# Altium project avris_vest.PrjPcb
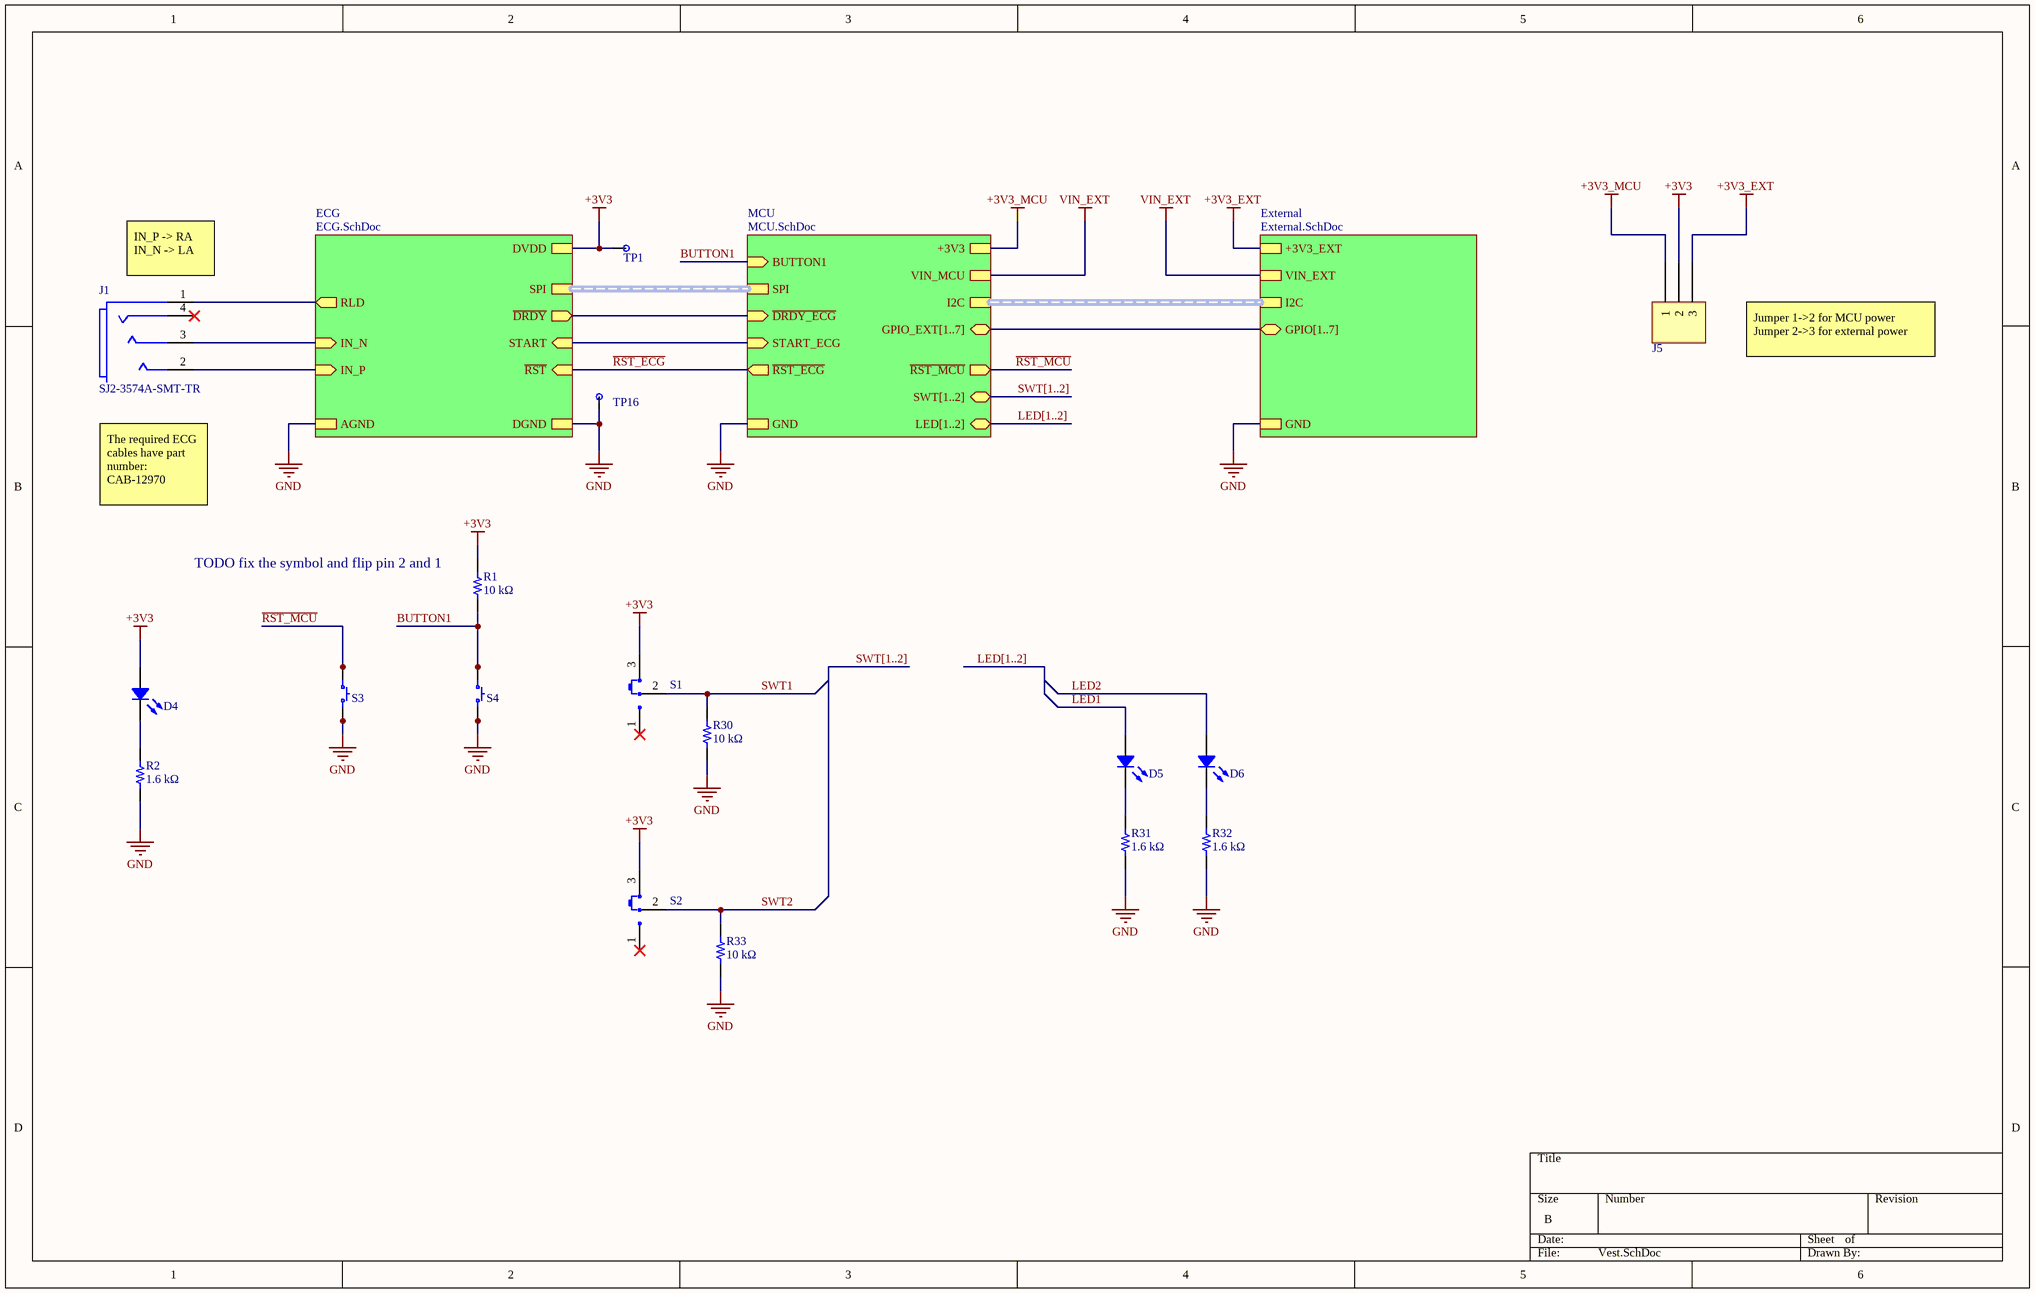
[diagram p0: Vest.SchDoc]
4 sheets, 89 parts. Net scope: strictly hierarchical (ports join the sheet entries above them; power ports are local).
Board file: Vest.PcbDoc
Sheets:
  Vest.SchDoc
    ECG = ECG.SchDoc
    MCU = MCU.SchDoc
    External = External.SchDoc

## Sheet Vest.SchDoc
size B; DocumentNumber: 1; SheetNumber: 1; SheetTotal: 4

### Parts
D4  Red  [LED 1206_3216 RED]  (value not drawn)
D5  Red  [LED 1206_3216 RED]  (value not drawn)
D6  Red  [LED 1206_3216 RED]  (value not drawn)
J1  SJ2-3574A-SMT-TR  [CUI SJ2-3574A-SMT-TR]
J5  0022272031  [MOLEX KK 0022272031]  (value not drawn)
R1  10 kΩ  [RES 0402_1005]
R2  1.6 kΩ  [RES 0402_1005]
R30  10 kΩ  [RES 0402_1005]
R31  1.6 kΩ  [RES 0402_1005]
R32  1.6 kΩ  [RES 0402_1005]
R33  10 kΩ  [RES 0402_1005]
S1  CUS-12TB  [NCE CUS-12TB]  (value not drawn)
S2  CUS-12TB  [NCE CUS-12TB]  (value not drawn)
S3  1571563-4  [TE FSM4JSMA]  (value not drawn)
S4  1571563-4  [TE FSM4JSMA]  (value not drawn)
TP1  TP2MM  [Test Point 2MM]  (value not drawn)  (no BOM)
TP16  TP2MM  [Test Point 2MM]  (value not drawn)  (no BOM)

### Sub-sheets
ECG = ECG.SchDoc: ~{RST} (in), START (in), ~{DRDY} (out), AGND, DGND, SPI (harness SPI), DVDD, IN_N (in), IN_P (in), RLD (out)
External = External.SchDoc: GND, GPIO[1..7] (bidir), I2C (harness I2C), +3V3_EXT, VIN_EXT
MCU = MCU.SchDoc: ~{RST_ECG} (out), ~{DRDY_ECG} (in), GND, SPI (harness SPI), +3V3, VIN_MCU, START_ECG (in), ~{RST_MCU} (out), I2C (harness I2C), GPIO_EXT[1..7] (bidir), SWT[1..2] (bidir), LED[1..2] (bidir), BUTTON1 (in)

### Nets
+3V3: D4.1 J5.2 R1.1 S1.3 S2.3 TP1.1 ; sheet ECG/DVDD
+3V3_EXT: J5.3 ; sheet External/+3V3_EXT
+3V3_MCU: J5.1 ; sheet MCU/+3V3
GND: R2.1 R30.2 R31.1 R32.1 R33.2 S3.3 S3.4 S4.3 S4.4 TP16.1 ; sheet ECG/AGND, sheet ECG/DGND, sheet MCU/GND, sheet External/GND
VIN_EXT: sheet MCU/VIN_MCU, sheet External/VIN_EXT
BUTTON1: R1.2 S4.1 S4.2 ; sheet MCU/BUTTON1
~{DRDY_ECG}: sheet ECG/~{DRDY}, sheet MCU/~{DRDY_ECG}
IN_N: J1.3(ring_1) ; sheet ECG/IN_N
IN_P: J1.2(tip) ; sheet ECG/IN_P
LED1: D5.1
LED2: D6.1
~{RST_ECG}: sheet ECG/~{RST}, sheet MCU/~{RST_ECG}
~{RST_MCU}: S3.1 S3.2 ; sheet MCU/~{RST_MCU}  [project net ~{RST_MCU}]
START_ECG: sheet ECG/START, sheet MCU/START_ECG
SWT1: R30.1 S1.2(COM)
SWT2: R33.1 S2.2(COM)
NetD4_2: D4.2 R2.2
NetD5_2: D5.2 R31.2
NetD6_2: D6.2 R32.2
NetJ1_1: J1.1(sleeve) ; sheet ECG/RLD

Not connected (* = marked no-connect by the designer): J1 4(ring_2)*; S1 1*; S2 1*

### Buses and harness runs
bus LED[1..2]
bus LED[1..2] = sheet MCU/LED[1..2]
bus sheet External/GPIO[1..7] = sheet MCU/GPIO_EXT[1..7]
bus SWT[1..2]
bus SWT[1..2] = sheet MCU/SWT[1..2]
harness sheet ECG/SPI = sheet MCU/SPI
harness sheet External/I2C = sheet MCU/I2C

### Notes on the sheet
- (near J1) IN_P -> RA
  IN_N -> LA
- Jumper 1->2 for MCU power
  Jumper 2->3 for external power
- The required ECG cables have part number: CAB-12970
- (near R1) TODO fix the symbol and flip pin 2 and 1

### Library data of the parts
D4-D6 = APT3216LSECK/J3-PRV: LED RED CLEAR 2SMD; Manufacturer: Kingbright; Configuration: Standard; Current - Test: 2mA; Lens Color: Colorless; Lens Size: 1.90mm x 1.60mm; Lens Style: Rectangle with Flat Top; Millicandela Rating: 40mcd; Viewing Angle: 120°; Voltage - Forward (Vf) (Typ): 1.8V; Wavelength - Dominant: 625nm; Wavelength - Peak: 640nm; Part Number: APT3216LSECK/J3-PRV; Color: Red; ComponentLink1Description: Datasheet; ComponentLink1URL: http://www.kingbrightusa.com/images/catalog/SPEC/APT3216LSECK-J3-PRV.pdf; ComponentLink2Description: DigiKey Link; ComponentLink2URL: http://digikey.com/product-detail/en/kingbright/APT3216LSECK-J3-PRV/754-1940-1-ND/5177470; Device Package: 1206 (3216 Metric); Height (Max): 0.75mm; LastUpdated: 2020-02-03 5:16:26 PM; Lens Transparency: Clear; Lifecycle Status: Active; Minimum Order: 1; Mounting Type: Surface Mount; Package / Case: 1206 (3216 Metric); Packaging: TapeAndReel; Part Status: Active; Price: 0.16; Series: HELI2; Size / Dimension: 3.20mm L x 1.60mm W; Supplier 1: DigiKey; Supplier Part Number 1: 754-1940-1-ND; Supplier Device Package: 2-SMD; Value: Red
J1 = SJ2-3574A-SMT-TR: AUDIO JACK, 3.5 MM, RT, 4 CONDUC; Manufacturer: CUI Devices; Connector Type: Phone Jack; Gender: Female; Internal Switch(s): Does Not Contain Switch; Mating Length/Depth: 0.551"" (14.00mm); Current Rating: 1A; Shielding: Unshielded; Voltage - Rated: 12VDC; Number of Positions/Contacts: 4 Conductors, 4 Contacts; Part Number: SJ2-3574A-SMT-TR; ComponentLink1Description: Datasheet; ComponentLink1URL: https://www.cuidevices.com/product/resource/digikeypdf/sj2-357x-smt.pdf; ComponentLink2Description: DigiKey Link; ComponentLink2URL: https://www.digikey.com/en/products/detail/cui-devices/SJ2-3574A-SMT-TR/6619530?s=N4IgTCBcDaIMoCkwFoDMBWA7AFgILLgFkAVZYgJRAF0BfIA; Device Package: Tape and Reel; Features: Board Guide; LastUpdated: 2020-08-26 1:45:56 AM; Lifecycle Status: 1; Minimum Order: 1; Mounting Type: Surface Mount, Right Angle; Packaging: Tape and Reel; Part Status: Active; Price: 1.15; Series: SJ2; Supplier 1: DigiKey; Supplier Part Number 1: CP-SJ2-3574A-SMT-TR-ND
J5 = 0022272031: CONN HEADER VERT 3POS 2.54MM; Manufacturer: Molex; Contact Length - Mating: 0.295" (7.49mm); Contact Length - Post: 0.140" (3.56mm); Material Flammability Rating: UL94 V-0; Number of Positions: 3; Number of Positions Loaded: All; Overall Contact Length: 0.560" (14.22mm); Pitch - Mating: 0.100" (2.54mm); Shrouding: Shrouded - 1 Wall; Style: Board to Cable/Wire; Part Number: 0022272031; ComponentLink1Description: Datasheet; ComponentLink1URL: https://www.molex.com/pdm_docs/sd/022272031_sd.pdf; ComponentLink2Description: DigiKey Link; ComponentLink2URL: http://digikey.com/product-detail/en/molex/0022272031/WM4112-ND/1130578; Connector Type: Header; Contact Finish - Mating: Tin; Contact Finish - Post: Tin; Contact Finish Thickness - Mating: 100.0µin (2.54µm); Contact Material: Brass; Contact Shape: Square; Contact Type: Male Pin; Fastening Type: Friction Lock; Insulation Color: Natural; Insulation Height: 0.461" (11.70mm); Insulation Material: Polyamide (PA), Nylon; LastUpdated: 2020-02-03 5:11:43 PM; Lifecycle Status: Active; Minimum Order: 1; Mounting Type: Through Hole; Number of Rows: 1; Packaging: Bulk; Part Status: Active; Price: 0.37; Series: KK 6410; Supplier 1: DigiKey; Supplier Part Number 1: WM4112-ND; Termination: Solder
R1 R30 R33 = AC0402FR-0710KL: RES SMD 10K OHM 1% 1/16W 0402; Manufacturer: Yageo; Power (Watts): 0.063W, 1/16W; Temperature Coefficient: ±100ppm/°C; Value: 10 kOhms; Part Number: AC0402FR-0710KL; ComponentLink1Description: Datasheet; ComponentLink1URL: https://www.yageo.com/upload/media/product/productsearch/datasheet/rchip/PYu-AC_51_RoHS_L_7.pdf; ComponentLink2Description: DigiKey Link; ComponentLink2URL: http://digikey.com/product-detail/en/yageo/AC0402FR-0710KL/YAG3436CT-ND/6006285; Composition: Thick Film; Device Package: 0402 (1005 Metric); Features: Automotive AEC-Q200, Moisture Resistant; Height - Seated (Max): 0.015" (0.37mm); LastUpdated: 2020-02-19 6:28:05 AM; Lifecycle Status: Active; Minimum Order: 1; Number of Terminations: 2; Operating Temperature: -55°C ~ 155°C; Package / Case: 0402 (1005 Metric); Packaging: CutTape; Part Status: Active; Price: 0.10; Ratings: AEC-Q200; Resistance: 10 kΩ; Series: AC; Size / Dimension: 0.039" L x 0.020" W (1.00mm x 0.50mm); Supplier 1: DigiKey; Supplier Part Number 1: YAG3436CT-ND; Supplier Device Package: 0402; Tolerance: ±1%
R2 R31 R32 = CRCW04021K60FKED: RES SMD 1.6K OHM 1% 1/16W 0402; Manufacturer: Vishay Dale; Power (Watts): 0.063W, 1/16W; Temperature Coefficient: ±100ppm/°C; Value: 1.6 kOhms; Part Number: CRCW04021K60FKED; ComponentLink1Description: Datasheet; ComponentLink1URL: http://www.vishay.com/docs/20035/dcrcwe3.pdf; ComponentLink2Description: DigiKey Link; ComponentLink2URL: http://digikey.com/product-detail/en/vishay-dale/CRCW04021K60FKED/541-1.60KLCT-ND/1183144; Composition: Thick Film; Device Package: 0402 (1005 Metric); Features: Automotive AEC-Q200; Height - Seated (Max): 0.016" (0.40mm); LastUpdated: 2020-02-19 6:28:05 AM; Lifecycle Status: Active; Minimum Order: 1; Number of Terminations: 2; Operating Temperature: -55°C ~ 155°C; Package / Case: 0402 (1005 Metric); Packaging: CutTape; Part Status: Active; Price: 0.10; Ratings: AEC-Q200; Resistance: 1.6 kΩ; Series: CRCW; Size / Dimension: 0.039" L x 0.020" W (1.00mm x 0.50mm); Supplier 1: DigiKey; Supplier Part Number 1: 541-1.60KLCT-ND; Supplier Device Package: 0402; Tolerance: ±1%
S1 S2 = CUS-12TB: SWITCH SLIDE SPDT 300MA 4V; Manufacturer: Nidec Copal Electronics; Actuator Length: 1.50mm; Actuator Type: Standard; Contact Timing: Non-Shorting (BBM); Current Rating (Amps): 300mA (DC); Switch Function: On-On; Part Number: CUS-12TB; Circuit: SPDT; ComponentLink1Description: Datasheet; ComponentLink1URL: https://www.nidec-copal-electronics.com/e/catalog/switch/cus.pdf; ComponentLink2Description: DigiKey Link; ComponentLink2URL: https://www.digikey.com/product-detail/en/nidec-copal-electronics/CUS-12TB/563-1102-2-ND/1124222; Contact Finish: Gold; Contact Material: Copper Alloy; LastUpdated: 2020-03-02 6:46:22 AM; Lifecycle Status: Active; Minimum Order: 1; Mounting Type: Surface Mount, Right Angle; Operating Temperature: -20°C ~ 70°C; Packaging: TapeAndReel; Part Status: Active; Price: 0.71; Series: CUS; Supplier 1: DigiKey; Supplier Part Number 1: 563-1102-1-ND; Termination Style: Gull Wing; Voltage Rating - AC: 4V; Voltage Rating - DC: 4V
S3 S4 = 1571563-4: SWITCH TACTILE SPST-NO 0.05A 24V; Manufacturer: TE Connectivity ALCOSWITCH Switches; Actuator Height off PCB, Vertical: 5.00mm; Actuator Orientation: Top Actuated; Actuator Type: Standard; Contact Rating @ Voltage: 0.05A @ 24VDC; Illumination: Non-Illuminated; Operating Force: 260gf; Outline: 6.00mm x 6.00mm; Switch Function: Off-Mom; Part Number: 1571563-4; Circuit: SPST-NO; ComponentLink1Description: Datasheet; ComponentLink1URL: https://www.te.com/commerce/DocumentDelivery/DDEController?Action=srchrtrv&DocNm=1308111-1_SWITCHES_CORE_PROGRAM_CATALOG&DocType=CS&DocLang=English; ComponentLink2Description: DigiKey Link; ComponentLink2URL: http://digikey.com/product-detail/en/te-connectivity-alcoswitch-switches/1571563-4/450-2055-1-ND/4569745; LastUpdated: 2020-12-16 5:46:49 AM; Lifecycle Status: Active; Minimum Order: 1; Mounting Type: Surface Mount; Operating Temperature: -35°C ~ 85°C; Packaging: TapeAndReel; Part Status: Active; Price: 0.16; Series: FSMJSMA; Supplier 1: DigiKey; Supplier Part Number 1: 450-2055-1-ND; Termination Style: Gull Wing
TP1 TP16 = TP2MM: 2MM Circular Test Point; Part Number: TP2MM

## Sheet ECG.SchDoc
size C; DocumentNumber: 2; SheetNumber: 2; SheetTotal: 4
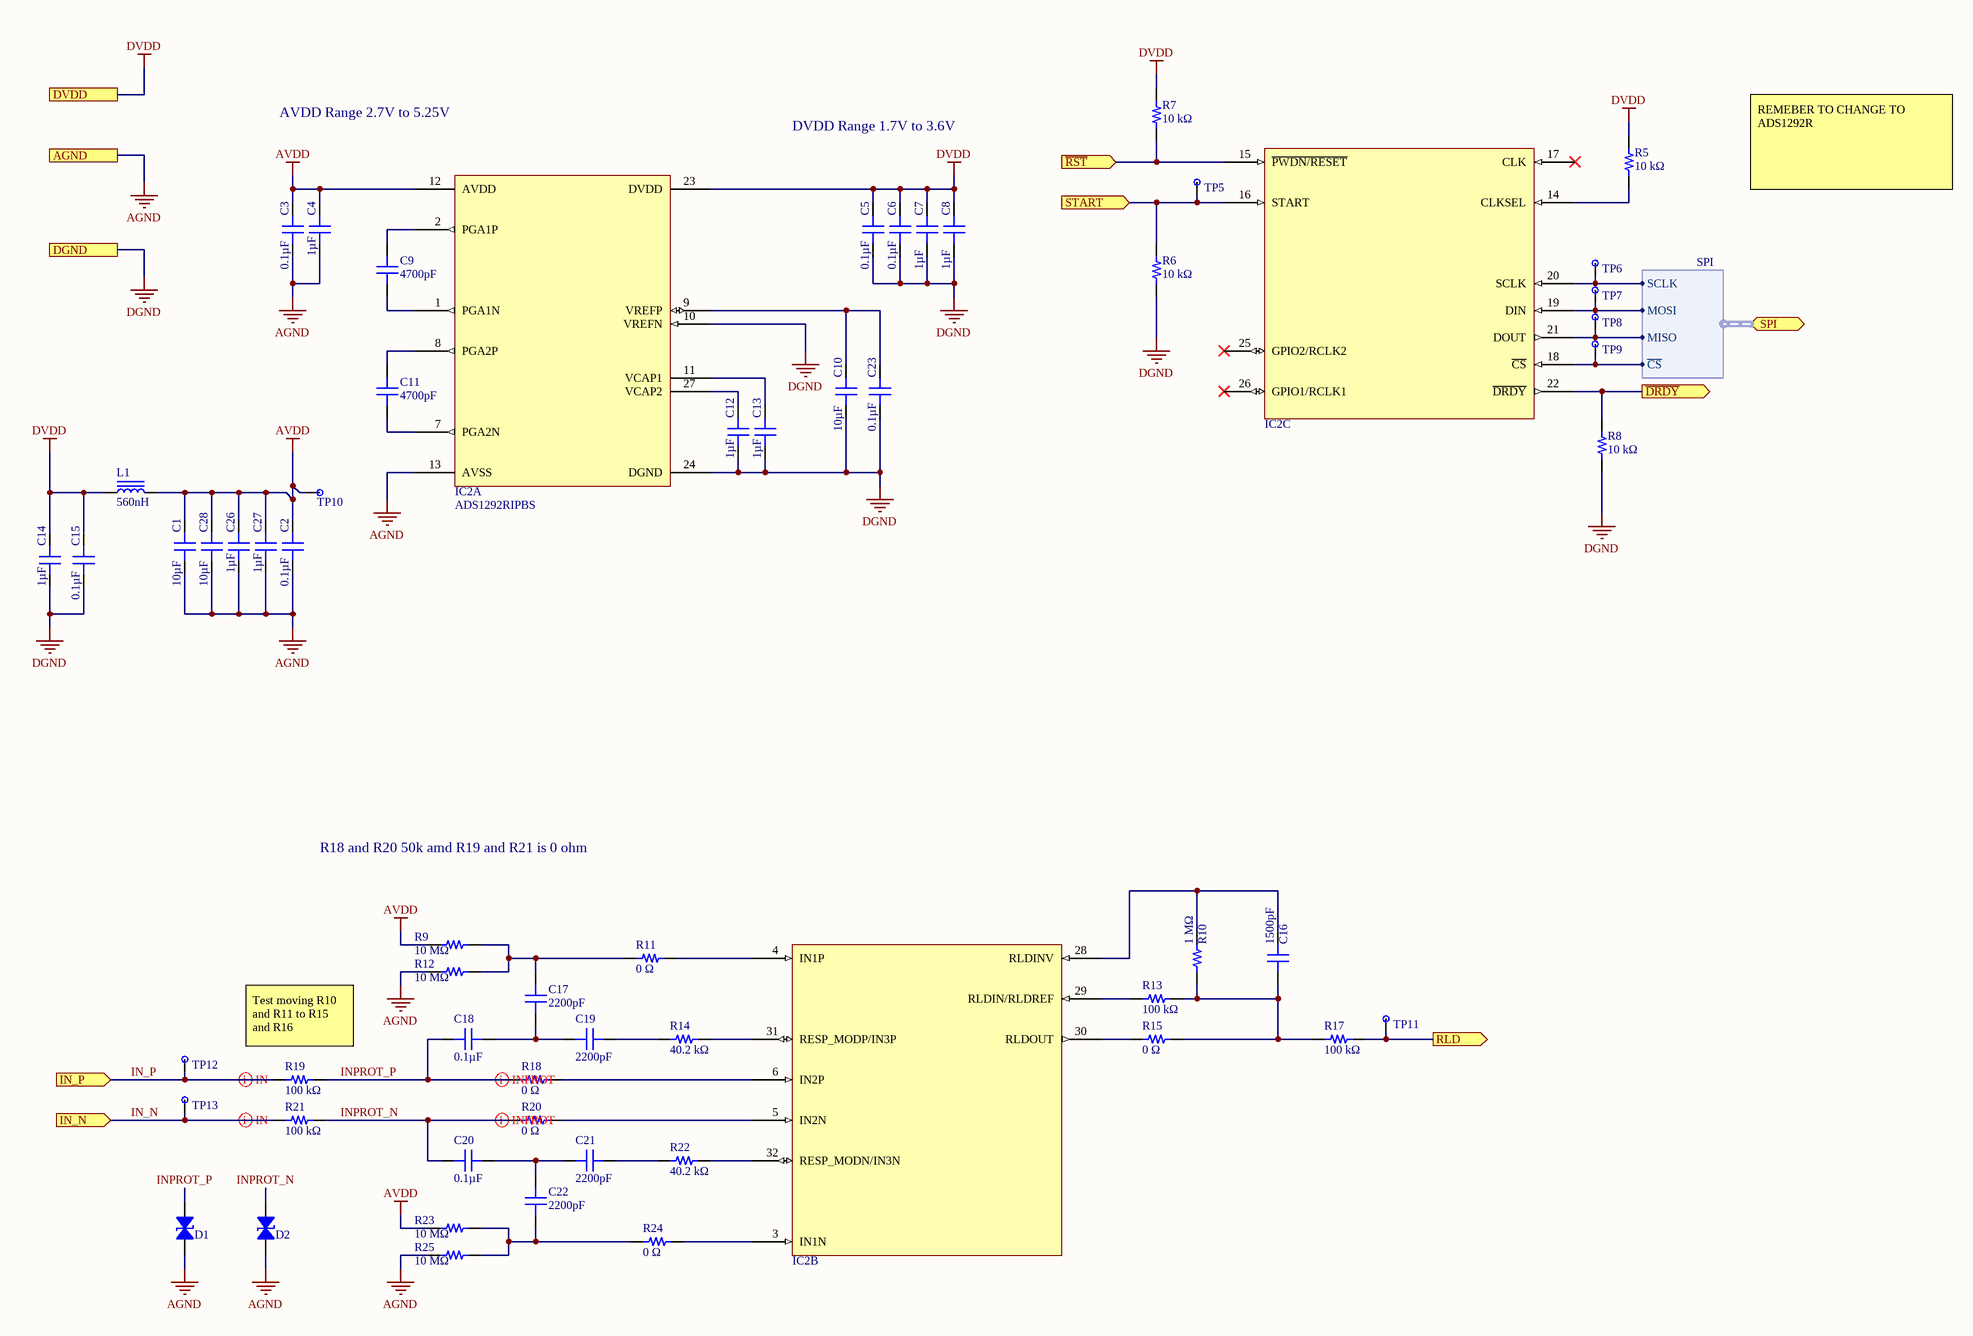
[diagram p1: ECG.SchDoc]

### Parts
C1  10µF  [CAP 0402_1005]
C2  0.1µF  [CAP 0402_1005]
C3  0.1µF  [CAP 0402_1005]
C4  1µF  [CAP 0402_1005]
C5  0.1µF  [CAP 0402_1005]
C6  0.1µF  [CAP 0402_1005]
C7  1µF  [CAP 0402_1005]
C8  1µF  [CAP 0402_1005]
C9  4700pF  [CAP 0402_1005]
C10  10µF  [CAP 0402_1005]
C11  4700pF  [CAP 0402_1005]
C12  1µF  [CAP 0402_1005]
C13  1µF  [CAP 0402_1005]
C14  1µF  [CAP 0402_1005]
C15  0.1µF  [CAP 0402_1005]
C16  1500pF  [CAP 0402_1005]
C17  2200pF  [CAP 0402_1005]
C18  0.1µF  [CAP 0402_1005]
C19  2200pF  [CAP 0402_1005]
C20  0.1µF  [CAP 0402_1005]
C21  2200pF  [CAP 0402_1005]
C22  2200pF  [CAP 0402_1005]
C23  0.1µF  [CAP 0402_1005]
C26  1µF  [CAP 0402_1005]
C27  1µF  [CAP 0402_1005]
C28  10µF  [CAP 0402_1005]
D1  PESD5V0X1BT,215  [DIODES SOT-23-3]  (value not drawn)
D2  PESD5V0X1BT,215  [DIODES SOT-23-3]  (value not drawn)
IC2  ADS1292RIPBS  [TI PQFP-32 5X5MM]  (parts A,B,C of 3)
L1  560nH  [IND 0402_1005]
R5  10 kΩ  [RES 0402_1005]
R6  10 kΩ  [RES 0402_1005]
R7  10 kΩ  [RES 0402_1005]
R8  10 kΩ  [RES 0402_1005]
R9  10 MΩ  [RES 0402_1005]
R10  1 MΩ  [RES 0402_1005]
R11  0 Ω  [RES 0402_1005]
R12  10 MΩ  [RES 0402_1005]
R13  100 kΩ  [RES 0402_1005]
R14  40.2 kΩ  [RES 0402_1005]
R15  0 Ω  [RES 0402_1005]
R17  100 kΩ  [RES 0402_1005]
R18  0 Ω  [RES 0402_1005]
R19  100 kΩ  [RES 0402_1005]
R20  0 Ω  [RES 0402_1005]
R21  100 kΩ  [RES 0402_1005]
R22  40.2 kΩ  [RES 0402_1005]
R23  10 MΩ  [RES 0402_1005]
R24  0 Ω  [RES 0402_1005]
R25  10 MΩ  [RES 0402_1005]
TP5  TP1MM  [Test Point 1MM]  (value not drawn)  (no BOM)
TP6  TP1MM  [Test Point 1MM]  (value not drawn)  (no BOM)
TP7  TP1MM  [Test Point 1MM]  (value not drawn)  (no BOM)
TP8  TP1MM  [Test Point 1MM]  (value not drawn)  (no BOM)
TP9  TP1MM  [Test Point 1MM]  (value not drawn)  (no BOM)
TP10  TP2MM  [Test Point 2MM]  (value not drawn)  (no BOM)
TP11  TP1MM  [Test Point 1MM]  (value not drawn)  (no BOM)
TP12  TP1MM  [Test Point 1MM]  (value not drawn)  (no BOM)
TP13  TP1MM  [Test Point 1MM]  (value not drawn)  (no BOM)

### Ports
AGND, DGND, DVDD, IN_N (in), IN_P (in), RLD (out), SPI (bidir, harness SPI), START (in), ~{DRDY} (out), ~{RST} (in)

### Harnesses
SPI: SCLK, MOSI, MISO, ~{CS}

### Nets
AGND: C1.2 C2.2 C3.2 C4.2 C5.2 C6.2 C7.2 C8.2 C10.2 C12.2 C13.2 C14.2 C15.2 C23.2 C26.2 C27.2 C28.2 D1.1 D2.1 IC2.10(VREFN) IC2.13(AVSS) IC2.24(DGND) R6.2 R8.2 R12.1 R25.1 ; port AGND, port DGND  [also labelled DGND]  [project net GND]
AVDD: C1.1 C2.1 C3.1 C4.1 C26.1 C27.1 C28.1 IC2.12(AVDD) L1.2 R9.1 R23.1 TP10.1
DVDD: C5.1 C6.1 C7.1 C8.1 C14.1 C15.1 IC2.23(DVDD) L1.1 R5.1 R7.1 ; port DVDD  [project net +3V3]
~{CS}: IC2.18(~{CS}) TP9.1 ; port SPI.~{CS}
~{DRDY_ECG}: IC2.22(~{DRDY}) R8.1 ; port ~{DRDY}
IN_N: R21.2 TP13.1 ; port IN_N
IN_P: R19.2 TP12.1 ; port IN_P
INPROT_N: C20.2 D2.2 R20.2 R21.1
INPROT_P: C18.2 D1.2 R18.2 R19.1
~{RST_ECG}: IC2.15(~{PWDN/RESET}) R7.2 ; port ~{RST}
SPI_MISO: IC2.21(DOUT) TP8.1 ; port SPI.MISO
SPI_MOSI: IC2.19(DIN) TP7.1 ; port SPI.MOSI
SPI_SCLK: IC2.20(SCLK) TP6.1 ; port SPI.SCLK
START_ECG: IC2.16(START) R6.1 TP5.1 ; port START
NetC9_1: C9.1 IC2.2(PGA1P)
NetC9_2: C9.2 IC2.1(PGA1N)
NetC10_1: C10.1 C23.1 IC2.9(VREFP)
NetC11_1: C11.1 IC2.8(PGA2P)
NetC11_2: C11.2 IC2.7(PGA2N)
NetC12_1: C12.1 IC2.27(VCAP2)
NetC13_1: C13.1 IC2.11(VCAP1)
NetC16_1: C16.1 IC2.28(RLDINV) R10.1
NetC16_2: C16.2 R10.2 R13.2 R15.1 R17.2
NetC17_1: C17.1 R9.2 R11.2 R12.2
NetC17_2: C17.2 C18.1 C19.2
NetC19_1: C19.1 R14.2
NetC20_1: C20.1 C21.2 C22.1
NetC21_1: C21.1 R22.2
NetC22_2: C22.2 R23.2 R24.2 R25.2
NetIC2_3: IC2.3(IN1N) R24.1
NetIC2_4: IC2.4(IN1P) R11.1
NetIC2_5: IC2.5(IN2N) R20.1
NetIC2_6: IC2.6(IN2P) R18.1
NetIC2_14: IC2.14(CLKSEL) R5.2
NetIC2_29: IC2.29(RLDIN/RLDREF) R13.1
NetIC2_30: IC2.30(RLDOUT) R15.2
NetIC2_31: IC2.31(RESP_MODP/IN3P) R14.1
NetIC2_32: IC2.32(RESP_MODN/IN3N) R22.1
NetJ1_1: R17.1 TP11.1 ; port RLD

Not connected (* = marked no-connect by the designer): IC2 17(CLK)* 25(GPIO2/RCLK2)* 26(GPIO1/RCLK1)*

### Layout directives
differential pair: IN_N, IN_P, INPROT_N, INPROT_P

### Notes on the sheet
- AVDD Range 2.7V to 5.25V
- DVDD Range 1.7V to 3.6V
- REMEBER TO CHANGE TO ADS1292R
- R18 and R20 50k amd R19 and R21 is 0 ohm
- (near R19) Test moving R10 and R11 to R15 and R16

### Library data of the parts
C1 C10 C28 = 0402ZD106MAT2A: CAP CER 10UF 10V X5R 0402; Manufacturer: AVX Corporation; Tolerance: ±20%; Part Number: 0402ZD106MAT2A; Applications: General Purpose; Capacitance: 10µF; ComponentLink1Description: Datasheet; ComponentLink1URL: http://datasheets.avx.com/cx5r.pdf; ComponentLink2Description: DigiKey Link; ComponentLink2URL: http://digikey.com/product-detail/en/avx-corporation/0402ZD106MAT2A/478-10052-1-ND/6564275; Device Package: 0402 (1005 Metric); LastUpdated: 2020-02-03 5:04:16 PM; Lifecycle Status: Active; Minimum Order: 1; Mounting Type: Surface Mount, MLCC; Operating Temperature: -55°C ~ 85°C; Package / Case: 0402 (1005 Metric); Packaging: TapeAndReel; Part Status: Active; Price: 0.24; Series: -; Size / Dimension: 0.039" L x 0.020" W (1.00mm x 0.50mm); Supplier 1: DigiKey; Supplier Part Number 1: 478-10052-1-ND; Temperature Coefficient: X5R; Thickness (Max): 0.028" (0.71mm); Value: 10µF; Voltage - Rated: 10V
C2 C3 C5 C6 C15 C23 = 04023C104JAT2A: CAP CER 0.1UF 25V X7R 0402; Manufacturer: AVX Corporation; Tolerance: ±5%; Part Number: 04023C104JAT2A; Applications: General Purpose; Capacitance: 0.1µF; ComponentLink1Description: Datasheet; ComponentLink1URL: http://datasheets.avx.com/X7RDielectric.pdf; ComponentLink2Description: DigiKey Link; ComponentLink2URL: http://digikey.com/product-detail/en/avx-corporation/04023C104JAT2A/478-10050-1-ND/6564273; Device Package: 0402 (1005 Metric); LastUpdated: 2020-02-03 5:03:51 PM; Lifecycle Status: Active; Minimum Order: 1; Mounting Type: Surface Mount, MLCC; Operating Temperature: -55°C ~ 125°C; Package / Case: 0402 (1005 Metric); Packaging: CutTape; Part Status: Active; Price: 0.14; Series: -; Size / Dimension: 0.039" L x 0.020" W (1.00mm x 0.50mm); Supplier 1: DigiKey; Supplier Part Number 1: 478-10050-1-ND; Temperature Coefficient: X7R; Thickness (Max): 0.022" (0.56mm); Value: 0.1µF; Voltage - Rated: 25V
C4 C7 C8 C12-C14 C26 C27 = 0402ZD105KAT2A: CAP CER 1UF 10V X5R 0402; Manufacturer: AVX Corporation; Tolerance: ±10%; Part Number: 0402ZD105KAT2A; Applications: General Purpose; Capacitance: 1µF; ComponentLink1Description: Datasheet; ComponentLink1URL: http://datasheets.avx.com/cx5r.pdf; ComponentLink2Description: DigiKey Link; ComponentLink2URL: http://digikey.com/product-detail/en/avx-corporation/0402ZD105KAT2A/478-4596-1-ND/1645907; Device Package: 0402 (1005 Metric); LastUpdated: 2020-02-03 5:04:20 PM; Lifecycle Status: Active; Minimum Order: 1; Mounting Type: Surface Mount, MLCC; Operating Temperature: -55°C ~ 85°C; Package / Case: 0402 (1005 Metric); Packaging: TapeAndReel; Part Status: Active; Price: 0.03; Series: -; Size / Dimension: 0.039" L x 0.020" W (1.00mm x 0.50mm); Supplier 1: DigiKey; Supplier Part Number 1: 478-4596-1-ND; Temperature Coefficient: X5R; Thickness (Max): 0.022" (0.56mm); Value: 1µF; Voltage - Rated: 10V
C9 C11 = C0402C472K4RECAUTO: CAP CER 0402 4.7NF 16V X7R 10%; Manufacturer: KEMET; Part Number: C0402C472K4RECAUTO; Applications: Automotive, ESD Protection; Capacitance: 4700pF; ComponentLink1Description: Datasheet; ComponentLink1URL: https://api.kemet.com/component-edge/download/datasheet/C0402C472K4RECAUTO.pdf; ComponentLink2Description: DigiKey Link; ComponentLink2URL: http://digikey.com/product-detail/en/kemet/C0402C472K4RECAUTO/399-17875-1-ND/8640542; Device Package: 0402 (1005 Metric); LastUpdated: 2020-02-03 5:04:46 PM; Lifecycle Status: Active; Minimum Order: 1; Mounting Type: Surface Mount, MLCC; Operating Temperature: -55°C ~ 125°C; Package / Case: 0402 (1005 Metric); Packaging: TapeAndReel; Part Status: Active; Price: 0.02; Ratings: AEC-Q200; Series: ESD SMD Auto X7R; Size / Dimension: 0.039" L x 0.020" W (1.00mm x 0.50mm); Supplier 1: DigiKey; Supplier Part Number 1: 399-17875-1-ND; Temperature Coefficient: X7R; Thickness (Max): 0.022" (0.55mm); Tolerance: ±10%; Value: 4700pF; Voltage - Rated: 16V
C16 = C0402C152K5GECAUTO: CAP CER 0402 1.5NF 50V C0G 10%; Manufacturer: KEMET; Temperature Coefficient: C0G, NP0; Part Number: C0402C152K5GECAUTO; Applications: Automotive, ESD Protection; Capacitance: 1500pF; ComponentLink1Description: Datasheet; ComponentLink1URL: https://api.kemet.com/component-edge/download/datasheet/C0402C152K5GECAUTO.pdf; ComponentLink2Description: DigiKey Link; ComponentLink2URL: http://digikey.com/product-detail/en/kemet/C0402C152K5GECAUTO/399-17901-1-ND/8640568; Device Package: 0402 (1005 Metric); Features: Low ESL; LastUpdated: 2020-02-03 5:04:46 PM; Lifecycle Status: Active; Minimum Order: 1; Mounting Type: Surface Mount, MLCC; Operating Temperature: -55°C ~ 125°C; Package / Case: 0402 (1005 Metric); Packaging: TapeAndReel; Part Status: Active; Price: 0.02; Ratings: AEC-Q200; Series: ESD SMD Auto C0G; Size / Dimension: 0.039" L x 0.020" W (1.00mm x 0.50mm); Supplier 1: DigiKey; Supplier Part Number 1: 399-17901-1-ND; Thickness (Max): 0.022" (0.55mm); Tolerance: ±10%; Value: 1500pF; Voltage - Rated: 50V
C17 C19 C21 C22 = 04023C222JAT2A: CAP CER 2200PF 25V X7R 0402; Manufacturer: AVX Corporation; Tolerance: ±5%; Part Number: 04023C222JAT2A; Applications: General Purpose; Capacitance: 2200pF; ComponentLink1Description: Datasheet; ComponentLink1URL: http://datasheets.avx.com/X7RDielectric.pdf; ComponentLink2Description: DigiKey Link; ComponentLink2URL: http://digikey.com/product-detail/en/avx-corporation/04023C222JAT2A/478-12619-1-ND/9949157; Device Package: 0402 (1005 Metric); LastUpdated: 2020-02-03 5:04:22 PM; Lifecycle Status: Active; Minimum Order: 1; Mounting Type: Surface Mount, MLCC; Operating Temperature: -55°C ~ 125°C; Package / Case: 0402 (1005 Metric); Packaging: TapeAndReel; Part Status: Active; Price: 0.01; Series: -; Size / Dimension: 0.039" L x 0.020" W (1.00mm x 0.50mm); Supplier 1: DigiKey; Supplier Part Number 1: 478-12619-1-ND; Temperature Coefficient: X7R; Thickness (Max): 0.022" (0.56mm); Value: 2200pF; Voltage - Rated: 25V
C18 C20 = 0402B104J160CT: CAP CER 0.1UF 16V X7R 0402; Manufacturer: Walsin Technology Corporation; Tolerance: ±5%; Part Number: 0402B104J160CT; Applications: General Purpose; Capacitance: 0.1µF; ComponentLink1Description: Datasheet; ComponentLink1URL: http://www.passivecomponent.com/wp-content/uploads/2018/10/MLCC.pdf; ComponentLink2Description: DigiKey Link; ComponentLink2URL: http://digikey.com/product-detail/en/walsin-technology-corporation/0402B104J160CT/1292-1174-1-ND/9355178; Device Package: 0402 (1005 Metric); LastUpdated: 2020-02-03 5:04:13 PM; Lifecycle Status: Active; Minimum Order: 1; Mounting Type: Surface Mount, MLCC; Operating Temperature: -55°C ~ 125°C; Package / Case: 0402 (1005 Metric); Packaging: TapeAndReel; Part Status: Active; Price: 0.01; Series: -; Size / Dimension: 0.039" L x 0.020" W (1.00mm x 0.50mm); Supplier 1: DigiKey; Supplier Part Number 1: 1292-1174-1-ND; Temperature Coefficient: X7R; Thickness (Max): 0.022" (0.55mm); Value: 0.1µF; Voltage - Rated: 16V
D1 D2 = PESD5V0X1BT,215: TVS DIODE 5V SOT23; Manufacturer: Nexperia USA Inc.; Bidirectional Channels: 1; Capacitance @ Frequency: 0.9pF @ 1MHz; Power Line Protection: No; Type: Zener; Unidirectional Channels: 2; Voltage - Breakdown (Min): 5.8V; Voltage - Reverse Standoff (Typ): 5V (Max); Part Number: PESD5V0X1BT,215; Applications: Automotive; ComponentLink1Description: Datasheet; ComponentLink1URL: https://assets.nexperia.com/documents/data-sheet/PESD5V0X1BQ_PESD5V0X1BT.pdf; ComponentLink2Description: DigiKey Link; ComponentLink2URL: http://digikey.com/product-detail/en/nexperia-usa-inc/PESD5V0X1BT215/1727-4160-1-ND/1993013; Device Package: TO-236-3, SC-59, SOT-23-3; LastUpdated: 2020-02-03 5:12:31 PM; Lifecycle Status: Active; Minimum Order: 1; Mounting Type: Surface Mount; Operating Temperature: -55°C ~ 150°C (TA); Package / Case: TO-236-3, SC-59, SOT-23-3; Packaging: TapeAndReel; Part Status: Active; Price: 0.08; Series: Automotive, AEC-Q101; Supplier 1: DigiKey; Supplier Part Number 1: 1727-4160-1-ND; Supplier Device Package: TO-236AB
IC2 = ADS1292RIPBS: IC AFE 2 CHAN 24BIT 32TQFP; Manufacturer: Texas Instruments; Number of Bits: 24; Number of Channels: 2; Voltage - Supply, Analog: 2.7V ~ 5.25V; Voltage - Supply, Digital: 1.7V ~ 3.6V; Power (Watts): 740µW; Part Number: ADS1292RIPBS; ComponentLink1Description: Datasheet; ComponentLink1URL: http://www.ti.com/general/docs/suppproductinfo.tsp?distId=10&gotoUrl=http%3A%2F%2Fwww.ti.com%2Flit%2Fgpn%2Fads1292; ComponentLink2Description: DigiKey Link; ComponentLink2URL: https://www.digikey.com/product-detail/en/texas-instruments/ADS1292RIPBS/296-30331-5-ND/3137204; Device Package: 32-TQFP; LastUpdated: 2020-09-04 9:42:30 PM; Lifecycle Status: 1; Minimum Order: 1; Mounting Type: Surface Mount; Package / Case: 32-TQFP; Packaging: 32-TQFP (5x5); Part Status: Active; Price: 10.68; Supplier 1: Digikey; Supplier Part Number 1: 296-30331-5-ND
L1 = MLF1005GR56JT000: FIXED IND 560NH 45MA 470 MOHM; Manufacturer: TDK Corporation; DC Resistance (DCR): 470mOhm Max; Frequency - Self Resonant: 170MHz; Inductance Frequency - Test: 10MHz; Material - Core: Ferrite; Q @ Freq: 30 @ 10MHz; Shielding: Shielded; Tolerance: ±5%; Type: Multilayer; Part Number: MLF1005GR56JT000; ComponentLink1Description: Datasheet; ComponentLink1URL: https://product.tdk.com/info/en/catalog/datasheets/inductor_commercial_standard_mlf1005_en.pdf?ref_disty=digikey; ComponentLink2Description: DigiKey Link; ComponentLink2URL: http://digikey.com/product-detail/en/tdk-corporation/MLF1005GR56JT000/445-15694-1-ND/4327990; Current Rating (Amps): 45mA; Device Package: 0402 (1005 Metric); Height - Seated (Max): 0.022" (0.55mm); Inductance: 560nH; LastUpdated: 2020-02-03 5:15:45 PM; Lifecycle Status: Active; Minimum Order: 1; Mounting Type: Surface Mount; Operating Temperature: -55°C ~ 125°C; Package / Case: 0402 (1005 Metric); Packaging: TapeAndReel; Part Status: Active; Price: 0.10; Series: MLF; Size / Dimension: 0.039" L x 0.020" W (1.00mm x 0.50mm); Supplier 1: DigiKey; Supplier Part Number 1: 445-15694-1-ND; Supplier Device Package: 0402 (1005 Metric); Value: 560nH
R5-R8 = AC0402FR-0710KL: as R1 on sheet Vest; Part Number: AC0402FR-0710KL; ComponentLink1Description: Datasheet; ComponentLink1URL: https://www.yageo.com/upload/media/product/productsearch/datasheet/rchip/PYu-AC_51_RoHS_L_7.pdf; ComponentLink2Description: DigiKey Link; ComponentLink2URL: http://digikey.com/product-detail/en/yageo/AC0402FR-0710KL/YAG3436CT-ND/6006285; Composition: Thick Film; Device Package: 0402 (1005 Metric); Features: Automotive AEC-Q200, Moisture Resistant; Height - Seated (Max): 0.015" (0.37mm); LastUpdated: 2020-02-19 6:28:05 AM; Lifecycle Status: Active; Minimum Order: 1; Number of Terminations: 2; Operating Temperature: -55°C ~ 155°C; Package / Case: 0402 (1005 Metric); Packaging: CutTape; Part Status: Active; Price: 0.10; Ratings: AEC-Q200; Resistance: 10 kΩ; Series: AC; Size / Dimension: 0.039" L x 0.020" W (1.00mm x 0.50mm); Supplier 1: DigiKey; Supplier Part Number 1: YAG3436CT-ND; Supplier Device Package: 0402; Tolerance: ±1%
R9 R12 R23 R25 = AC0402FR-0710ML: RES SMD 10M OHM 1% 1/16W 0402; Manufacturer: Yageo; Power (Watts): 0.063W, 1/16W; Temperature Coefficient: ±100ppm/°C; Value: 10 MOhms; Part Number: AC0402FR-0710ML; ComponentLink1Description: Datasheet; ComponentLink1URL: https://www.yageo.com/upload/media/product/productsearch/datasheet/rchip/PYu-AC_51_RoHS_L_7.pdf; ComponentLink2Description: DigiKey Link; ComponentLink2URL: http://digikey.com/product-detail/en/yageo/AC0402FR-0710ML/YAG3437CT-ND/6006286; Composition: Thick Film; Device Package: 0402 (1005 Metric); Features: Automotive AEC-Q200, Moisture Resistant; Height - Seated (Max): 0.015" (0.37mm); LastUpdated: 2020-02-19 6:28:05 AM; Lifecycle Status: Active; Minimum Order: 1; Number of Terminations: 2; Operating Temperature: -55°C ~ 155°C; Package / Case: 0402 (1005 Metric); Packaging: CutTape; Part Status: Active; Price: 0.10; Ratings: AEC-Q200; Resistance: 10 MΩ; Series: AC; Size / Dimension: 0.039" L x 0.020" W (1.00mm x 0.50mm); Supplier 1: DigiKey; Supplier Part Number 1: YAG3437CT-ND; Supplier Device Package: 0402; Tolerance: ±1%
R10 = AC0402FR-071ML: RES SMD 1M OHM 1% 1/16W 0402; Manufacturer: Yageo; Power (Watts): 0.063W, 1/16W; Temperature Coefficient: ±100ppm/°C; Value: 1 MOhms; Part Number: AC0402FR-071ML; ComponentLink1Description: Datasheet; ComponentLink1URL: https://www.yageo.com/upload/media/product/productsearch/datasheet/rchip/PYu-AC_51_RoHS_L_7.pdf; ComponentLink2Description: DigiKey Link; ComponentLink2URL: http://digikey.com/product-detail/en/yageo/AC0402FR-071ML/YAG3450CT-ND/6006299; Composition: Thick Film; Device Package: 0402 (1005 Metric); Features: Automotive AEC-Q200, Moisture Resistant; Height - Seated (Max): 0.015" (0.37mm); LastUpdated: 2020-02-19 6:28:05 AM; Lifecycle Status: Active; Minimum Order: 1; Number of Terminations: 2; Operating Temperature: -55°C ~ 155°C; Package / Case: 0402 (1005 Metric); Packaging: CutTape; Part Status: Active; Price: 0.10; Ratings: AEC-Q200; Resistance: 1 MΩ; Series: AC; Size / Dimension: 0.039" L x 0.020" W (1.00mm x 0.50mm); Supplier 1: DigiKey; Supplier Part Number 1: YAG3450CT-ND; Supplier Device Package: 0402; Tolerance: ±1%
R11 R15 R18 R20 R24 = 5112: 0402 JUMPER ON TAPE AND REEL; Part Number: 5112; Manufacturer: Keystone Electronics; Power (Watts): 0.5W, 1/2W; Value: 0 Ohms; ComponentLink1Description: Datasheet; ComponentLink1URL: http://www.keystoneelectronics.net/ENG._DEPT/WEB_ORACLE/PDF/PDF%20CAT%20NO%20DRAWINGS/5000-5999/5112.PDF; ComponentLink2Description: DigiKey Link; ComponentLink2URL: http://digikey.com/product-detail/en/keystone-electronics/5112/36-5112-1-ND/9921855; Composition: Metal Element; Device Package: 0402 (1005 Metric); Height - Seated (Max): 0.020" (0.50mm); LastUpdated: 2020-02-19 6:28:05 AM; Lifecycle Status: Active; Minimum Order: 1; Number of Terminations: 2; Package / Case: 0402 (1005 Metric); Packaging: TapeAndReel; Part Status: Active; Price: 0.19; Resistance: 0 Ω; Series: -; Size / Dimension: 0.039" L x 0.020" W (1.00mm x 0.50mm); Supplier 1: DigiKey; Supplier Part Number 1: 36-5112-1-ND; Supplier Device Package: 0402; Tolerance: Jumper
R13 R17 R19 R21 = AC0402FR-07100KL: RES SMD 100K OHM 1% 1/16W 0402; Manufacturer: Yageo; Power (Watts): 0.063W, 1/16W; Temperature Coefficient: ±100ppm/°C; Value: 100 kOhms; Part Number: AC0402FR-07100KL; ComponentLink1Description: Datasheet; ComponentLink1URL: https://www.yageo.com/upload/media/product/productsearch/datasheet/rchip/PYu-AC_51_RoHS_L_7.pdf; ComponentLink2Description: DigiKey Link; ComponentLink2URL: http://digikey.com/product-detail/en/yageo/AC0402FR-07100KL/YAG3434CT-ND/6006283; Composition: Thick Film; Device Package: 0402 (1005 Metric); Features: Automotive AEC-Q200, Moisture Resistant; Height - Seated (Max): 0.015" (0.37mm); LastUpdated: 2020-02-19 6:28:05 AM; Lifecycle Status: Active; Minimum Order: 1; Number of Terminations: 2; Operating Temperature: -55°C ~ 155°C; Package / Case: 0402 (1005 Metric); Packaging: CutTape; Part Status: Active; Price: 0.10; Ratings: AEC-Q200; Resistance: 100 kΩ; Series: AC; Size / Dimension: 0.039" L x 0.020" W (1.00mm x 0.50mm); Supplier 1: DigiKey; Supplier Part Number 1: YAG3434CT-ND; Supplier Device Package: 0402; Tolerance: ±1%
R14 R22 = AT0402BRD0740K2L: RES SMD 40.2KOHM 0.1% 1/16W 0402; Manufacturer: Yageo; Power (Watts): 0.063W, 1/16W; Temperature Coefficient: ±25ppm/°C; Value: 40.2 kOhms; Part Number: AT0402BRD0740K2L; ComponentLink1Description: Datasheet; ComponentLink1URL: http://www.yageo.com/documents/recent/PYu-AT_51_RoHS_L_5.pdf; ComponentLink2Description: DigiKey Link; ComponentLink2URL: http://digikey.com/product-detail/en/yageo/AT0402BRD0740K2L/YAG2090CT-ND/5139538; Composition: Thin Film; Device Package: 0402 (1005 Metric); Features: Anti-Sulfur, Automotive AEC-Q200, Moisture Resistant; Height - Seated (Max): 0.014" (0.35mm); LastUpdated: 2020-02-19 6:28:05 AM; Lifecycle Status: Active; Minimum Order: 1; Number of Terminations: 2; Operating Temperature: -55°C ~ 155°C; Package / Case: 0402 (1005 Metric); Packaging: TapeAndReel; Part Status: Active; Price: 0.09; Ratings: AEC-Q200; Resistance: 40.2 kΩ; Series: AT; Size / Dimension: 0.039" L x 0.020" W (1.00mm x 0.50mm); Supplier 1: DigiKey; Supplier Part Number 1: YAG2090CT-ND; Supplier Device Package: 0402; Tolerance: ±0.1%
TP5-TP9 TP11-TP13 = TP1MM: 1MM Circular Test Point; Part Number: TP1MM
TP10 = TP2MM: 2MM Circular Test Point; Part Number: TP2MM

## Sheet MCU.SchDoc
size A
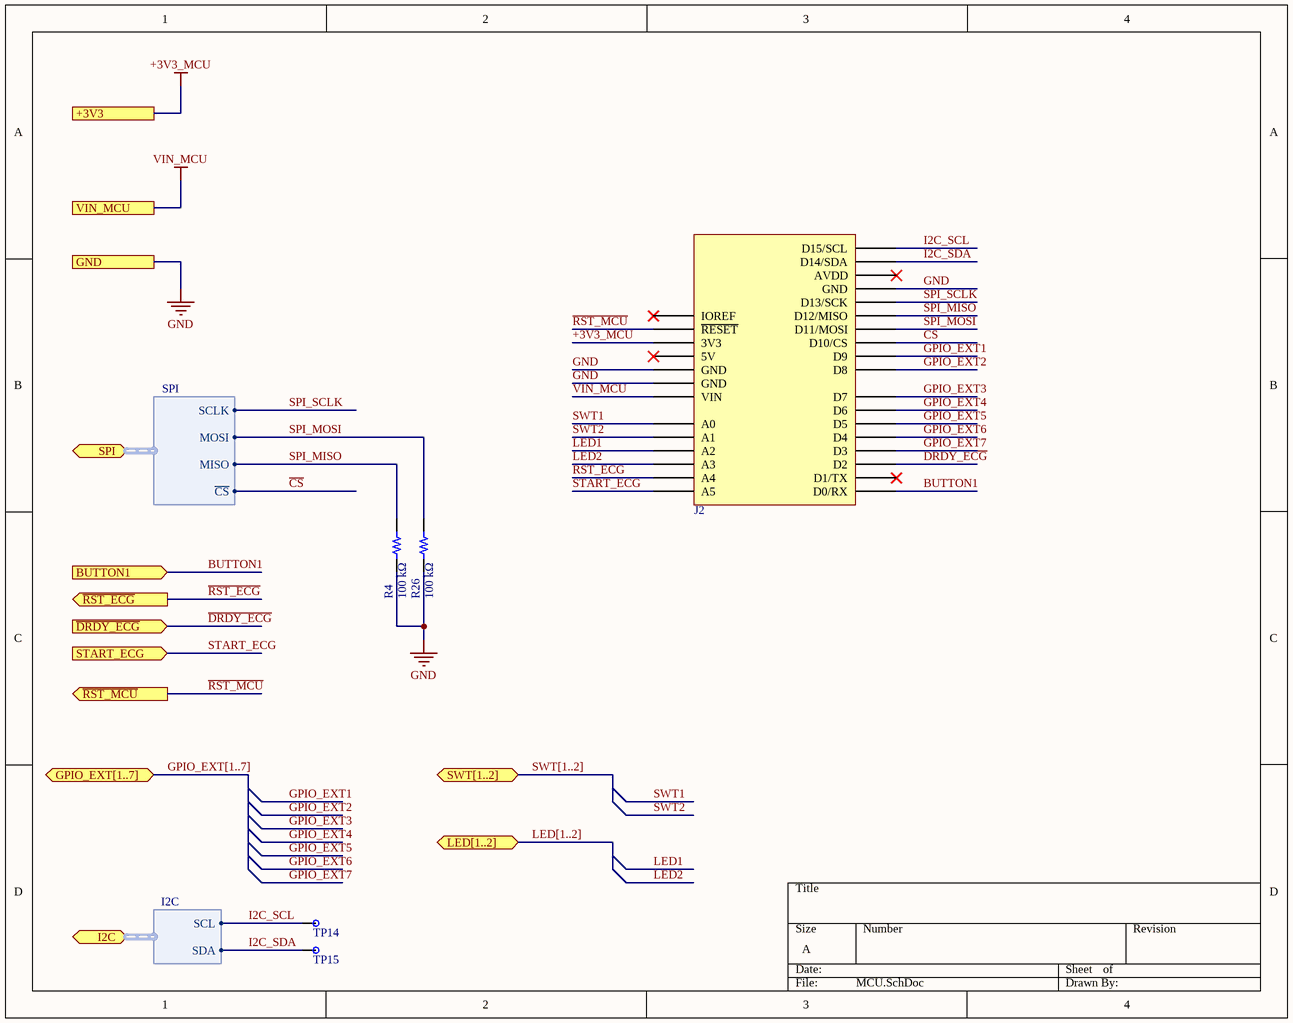
[diagram p2: MCU.SchDoc]

### Parts
J2  920-0088-01  [SCHMARTBOARD - 920-0088-01]  (value not drawn)
R4  100 kΩ  [RES 0402_1005]
R26  100 kΩ  [RES 0402_1005]
TP14  TP1MM  [Test Point 1MM]  (value not drawn)  (no BOM)
TP15  TP1MM  [Test Point 1MM]  (value not drawn)  (no BOM)

### Ports
+3V3, BUTTON1 (in), GND, GPIO_EXT[1..7] (bidir), I2C (bidir, harness I2C), LED[1..2] (bidir), SPI (bidir, harness SPI), START_ECG (in), SWT[1..2] (bidir), VIN_MCU, ~{DRDY_ECG} (in), ~{RST_ECG} (out), ~{RST_MCU} (out)

### Harnesses
SPI: SCLK, MOSI, MISO, ~{CS}
I2C: SCL, SDA

### Nets
+3V3_MCU: J2.4(3V3) ; port +3V3
GND: J2.6(GND) J2.7(GND) J2.29(GND) R4.2 R26.2 ; port GND
VIN_MCU: J2.8(VIN) ; port VIN_MCU  [project net VIN_EXT]
~{RST_MCU}: J2.3(~{RESET}) ; port ~{RST_MCU}
BUTTON1: J2.15(D0/RX) ; port BUTTON1
~{CS}: J2.25(D10/CS) ; port SPI.~{CS}
~{DRDY_ECG}: J2.17(D2) ; port ~{DRDY_ECG}
GPIO_EXT1: J2.24(D9)  [project net GPIO1]
GPIO_EXT2: J2.23(D8)  [project net GPIO2]
GPIO_EXT3: J2.22(D7)  [project net GPIO3]
GPIO_EXT4: J2.21(D6)  [project net GPIO4]
GPIO_EXT5: J2.20(D5)  [project net GPIO5]
GPIO_EXT6: J2.19(D4)  [project net GPIO6]
GPIO_EXT7: J2.18(D3)  [project net GPIO7]
I2C_SCL: J2.32(D15/SCL) TP14.1 ; port I2C.SCL
I2C_SDA: J2.31(D14/SDA) TP15.1 ; port I2C.SDA
LED1: J2.11(A2)
LED2: J2.12(A3)
~{RST_ECG}: J2.13(A4) ; port ~{RST_ECG}
SPI_MISO: J2.27(D12/MISO) R4.1 ; port SPI.MISO
SPI_MOSI: J2.26(D11/MOSI) R26.1 ; port SPI.MOSI
SPI_SCLK: J2.28(D13/SCK) ; port SPI.SCLK
START_ECG: J2.14(A5) ; port START_ECG
SWT1: J2.9(A0)
SWT2: J2.10(A1)

Not connected (* = marked no-connect by the designer): J2 2(IOREF)* 5(5V)* 16(D1/TX)* 30(AVDD)*

### Buses and harness runs
bus GPIO_EXT[1..7] = port GPIO_EXT[1..7]
bus LED[1..2] = port LED[1..2]
bus SWT[1..2] = port SWT[1..2]

### Library data of the parts
J2 = 920-0088-01: CONN HDR 8/10P 0.1 GOLD PCB 6PC; Manufacturer: Schmartboard, Inc.; Connector Type: Header; Contact Length - Post: 0.413" (10.50mm); Number of Positions: 6, 8, 10; Number of Positions Loaded: All; Pitch - Mating: 0.100" (2.54mm); Style: Board to Board; Part Number: 920-0088-01; ComponentLink1Description: Datasheet; ComponentLink1URL: http://schmartboard.com/content/Brochures/920-0088-01.pdf; ComponentLink2Description: DigiKey Link; ComponentLink2URL: http://digikey.com/product-detail/en/schmartboard-inc/920-0088-01/1988-1036-ND/9559319; Contact Finish - Mating: Gold; Contact Finish - Post: Gold; Contact Type: Female Socket; Fastening Type: Push-Pull; Insulation Color: Black; Insulation Height: 0.335" (8.51mm); LastUpdated: 2020-02-03 5:11:42 PM; Lifecycle Status: Active; Minimum Order: 1; Mounting Type: Through Hole; Number of Rows: 1; Packaging: Bulk; Part Status: Active; Price: 5.00; Series: -; Supplier 1: DigiKey; Supplier Part Number 1: 1988-1036-ND; Termination: Solder
R4 R26 = AC0402FR-07100KL: as R13 on sheet ECG; Part Number: AC0402FR-07100KL; ComponentLink1Description: Datasheet; ComponentLink1URL: https://www.yageo.com/upload/media/product/productsearch/datasheet/rchip/PYu-AC_51_RoHS_L_7.pdf; ComponentLink2Description: DigiKey Link; ComponentLink2URL: http://digikey.com/product-detail/en/yageo/AC0402FR-07100KL/YAG3434CT-ND/6006283; Composition: Thick Film; Device Package: 0402 (1005 Metric); Features: Automotive AEC-Q200, Moisture Resistant; Height - Seated (Max): 0.015" (0.37mm); LastUpdated: 2020-02-19 6:28:05 AM; Lifecycle Status: Active; Minimum Order: 1; Number of Terminations: 2; Operating Temperature: -55°C ~ 155°C; Package / Case: 0402 (1005 Metric); Packaging: CutTape; Part Status: Active; Price: 0.10; Ratings: AEC-Q200; Resistance: 100 kΩ; Series: AC; Size / Dimension: 0.039" L x 0.020" W (1.00mm x 0.50mm); Supplier 1: DigiKey; Supplier Part Number 1: YAG3434CT-ND; Supplier Device Package: 0402; Tolerance: ±1%
TP14 TP15 = TP1MM: 1MM Circular Test Point; Part Number: TP1MM

## Sheet External.SchDoc
size A
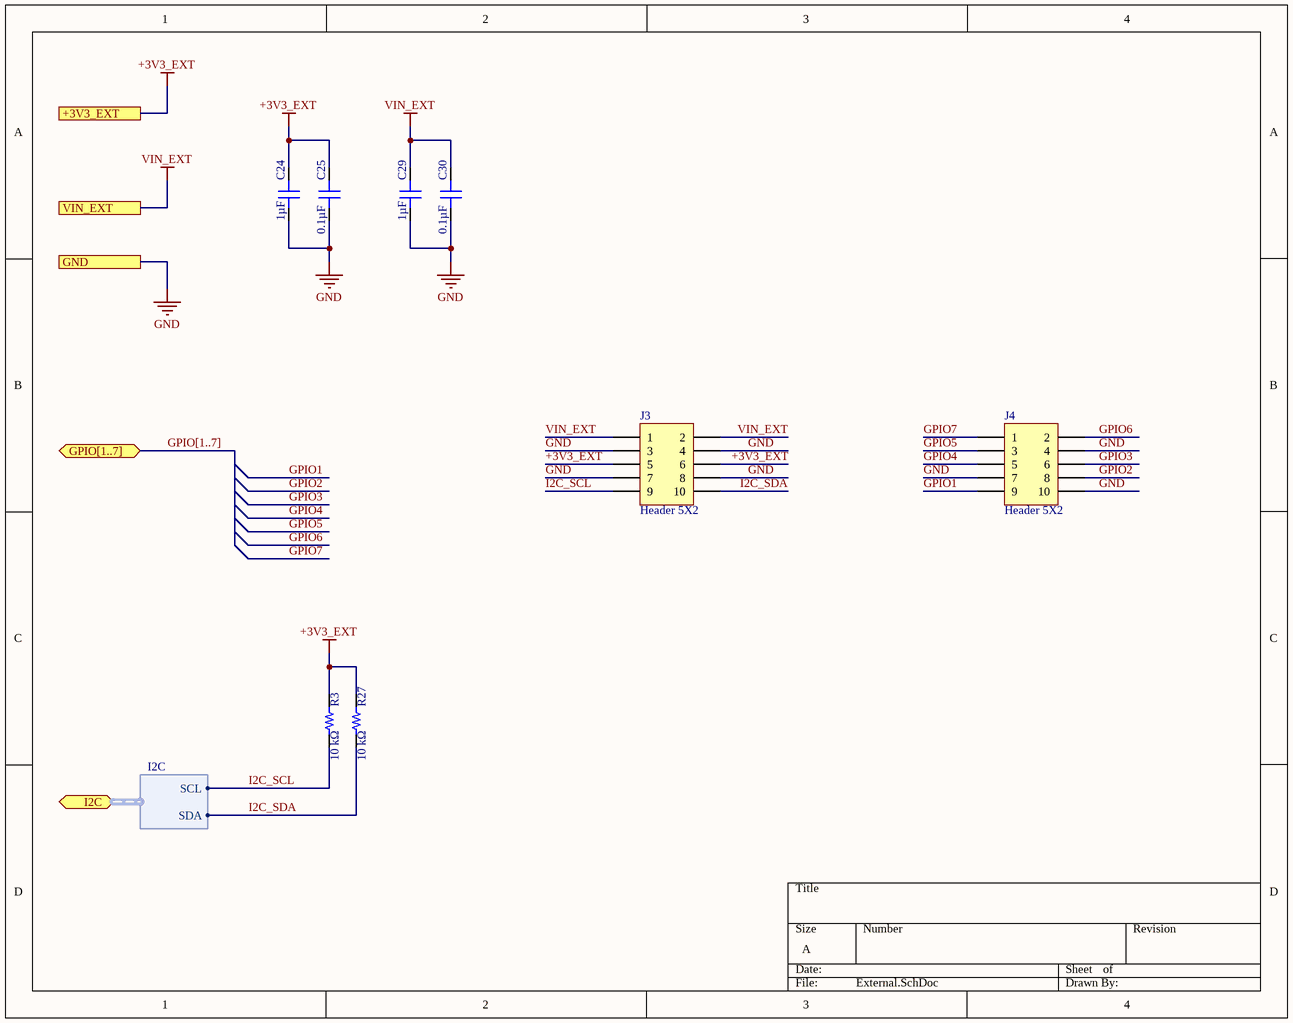
[diagram p3: External.SchDoc]

### Parts
C24  1µF  [CAP 0402_1005]
C25  0.1µF  [CAP 0402_1005]
C29  1µF  [CAP 0402_1005]
C30  0.1µF  [CAP 0402_1005]
J3  Header 5X2  [HDR2X5]
J4  Header 5X2  [HDR2X5]
R3  10 kΩ  [RES 0402_1005]
R27  10 kΩ  [RES 0402_1005]

### Ports
+3V3_EXT, GND, GPIO[1..7] (bidir), I2C (bidir, harness I2C), VIN_EXT

### Harnesses
I2C: SCL, SDA

### Nets
+3V3_EXT: C24.1 C25.1 J3.5 J3.6 R3.1 R27.1 ; port +3V3_EXT
GND: C24.2 C25.2 C29.2 C30.2 J3.3 J3.4 J3.7 J3.8 J4.4 J4.7 J4.10 ; port GND
VIN_EXT: C29.1 C30.1 J3.1 J3.2 ; port VIN_EXT
GPIO1: J4.9
GPIO2: J4.8
GPIO3: J4.6
GPIO4: J4.5
GPIO5: J4.3
GPIO6: J4.2
GPIO7: J4.1
I2C_SCL: J3.9 R3.2 ; port I2C.SCL
I2C_SDA: J3.10 R27.2 ; port I2C.SDA

### Buses and harness runs
bus GPIO[1..7] = port GPIO[1..7]

### Library data of the parts
C24 C29 = 0402ZD105KAT2A: as C4 on sheet ECG; Part Number: 0402ZD105KAT2A; Applications: General Purpose; Capacitance: 1µF; ComponentLink1Description: Datasheet; ComponentLink1URL: http://datasheets.avx.com/cx5r.pdf; ComponentLink2Description: DigiKey Link; ComponentLink2URL: http://digikey.com/product-detail/en/avx-corporation/0402ZD105KAT2A/478-4596-1-ND/1645907; Device Package: 0402 (1005 Metric); LastUpdated: 2020-02-03 5:04:20 PM; Lifecycle Status: Active; Minimum Order: 1; Mounting Type: Surface Mount, MLCC; Operating Temperature: -55°C ~ 85°C; Package / Case: 0402 (1005 Metric); Packaging: TapeAndReel; Part Status: Active; Price: 0.03; Series: -; Size / Dimension: 0.039" L x 0.020" W (1.00mm x 0.50mm); Supplier 1: DigiKey; Supplier Part Number 1: 478-4596-1-ND; Temperature Coefficient: X5R; Thickness (Max): 0.022" (0.56mm); Value: 1µF; Voltage - Rated: 10V
C25 C30 = 04023C104JAT2A: as C2 on sheet ECG; Part Number: 04023C104JAT2A; Applications: General Purpose; Capacitance: 0.1µF; ComponentLink1Description: Datasheet; ComponentLink1URL: http://datasheets.avx.com/X7RDielectric.pdf; ComponentLink2Description: DigiKey Link; ComponentLink2URL: http://digikey.com/product-detail/en/avx-corporation/04023C104JAT2A/478-10050-1-ND/6564273; Device Package: 0402 (1005 Metric); LastUpdated: 2020-02-03 5:03:51 PM; Lifecycle Status: Active; Minimum Order: 1; Mounting Type: Surface Mount, MLCC; Operating Temperature: -55°C ~ 125°C; Package / Case: 0402 (1005 Metric); Packaging: CutTape; Part Status: Active; Price: 0.14; Series: -; Size / Dimension: 0.039" L x 0.020" W (1.00mm x 0.50mm); Supplier 1: DigiKey; Supplier Part Number 1: 478-10050-1-ND; Temperature Coefficient: X7R; Thickness (Max): 0.022" (0.56mm); Value: 0.1µF; Voltage - Rated: 25V
J3 J4 = Header 5X2: Header, 5-Pin, Dual row; LatestRevisionDate: 17-Jul-2002; LatestRevisionNote: Re-released for DXP Platform.; Publisher: Altium Limited
R3 R27 = AC0402FR-0710KL: as R1 on sheet Vest; Part Number: AC0402FR-0710KL; ComponentLink1Description: Datasheet; ComponentLink1URL: https://www.yageo.com/upload/media/product/productsearch/datasheet/rchip/PYu-AC_51_RoHS_L_7.pdf; ComponentLink2Description: DigiKey Link; ComponentLink2URL: http://digikey.com/product-detail/en/yageo/AC0402FR-0710KL/YAG3436CT-ND/6006285; Composition: Thick Film; Device Package: 0402 (1005 Metric); Features: Automotive AEC-Q200, Moisture Resistant; Height - Seated (Max): 0.015" (0.37mm); LastUpdated: 2020-02-19 6:28:05 AM; Lifecycle Status: Active; Minimum Order: 1; Number of Terminations: 2; Operating Temperature: -55°C ~ 155°C; Package / Case: 0402 (1005 Metric); Packaging: CutTape; Part Status: Active; Price: 0.10; Ratings: AEC-Q200; Resistance: 10 kΩ; Series: AC; Size / Dimension: 0.039" L x 0.020" W (1.00mm x 0.50mm); Supplier 1: DigiKey; Supplier Part Number 1: YAG3436CT-ND; Supplier Device Package: 0402; Tolerance: ±1%

## Nets that join several sheets
+3V3: Vest (6 pins), ECG (10 pins)
+3V3_EXT: Vest (J5.3), External (6 pins)
+3V3_MCU: Vest (J5.1), MCU (J2.4)
GND: Vest (10 pins), ECG (26 pins), MCU (5 pins), External (11 pins)
VIN_EXT: MCU (J2.8), External (C29.1 C30.1 J3.1 J3.2)
~{RST_MCU}: Vest (S3.1 S3.2), MCU (J2.3)
BUTTON1: Vest (R1.2 S4.1 S4.2), MCU (J2.15)
~{CS}: ECG (IC2.18 TP9.1), MCU (J2.25)
~{DRDY_ECG}: ECG (IC2.22 R8.1), MCU (J2.17)
GPIO1: MCU (J2.24), External (J4.9)
GPIO2: MCU (J2.23), External (J4.8)
GPIO3: MCU (J2.22), External (J4.6)
GPIO4: MCU (J2.21), External (J4.5)
GPIO5: MCU (J2.20), External (J4.3)
GPIO6: MCU (J2.19), External (J4.2)
GPIO7: MCU (J2.18), External (J4.1)
I2C_SCL: MCU (J2.32 TP14.1), External (J3.9 R3.2)
I2C_SDA: MCU (J2.31 TP15.1), External (J3.10 R27.2)
IN_N: Vest (J1.3), ECG (R21.2 TP13.1)
IN_P: Vest (J1.2), ECG (R19.2 TP12.1)
LED1: Vest (D5.1), MCU (J2.11)
LED2: Vest (D6.1), MCU (J2.12)
NetJ1_1: Vest (J1.1), ECG (R17.1 TP11.1)
~{RST_ECG}: ECG (IC2.15 R7.2), MCU (J2.13)
SPI_MISO: ECG (IC2.21 TP8.1), MCU (J2.27 R4.1)
SPI_MOSI: ECG (IC2.19 TP7.1), MCU (J2.26 R26.1)
SPI_SCLK: ECG (IC2.20 TP6.1), MCU (J2.28)
START_ECG: ECG (IC2.16 R6.1 TP5.1), MCU (J2.14)
SWT1: Vest (R30.1 S1.2), MCU (J2.9)
SWT2: Vest (R33.1 S2.2), MCU (J2.10)

## Assembly variants
Internal RLD: not fitted IC2
External RLD: not fitted R2